# EAGLE design latest_01 (EAGLE 5.09)
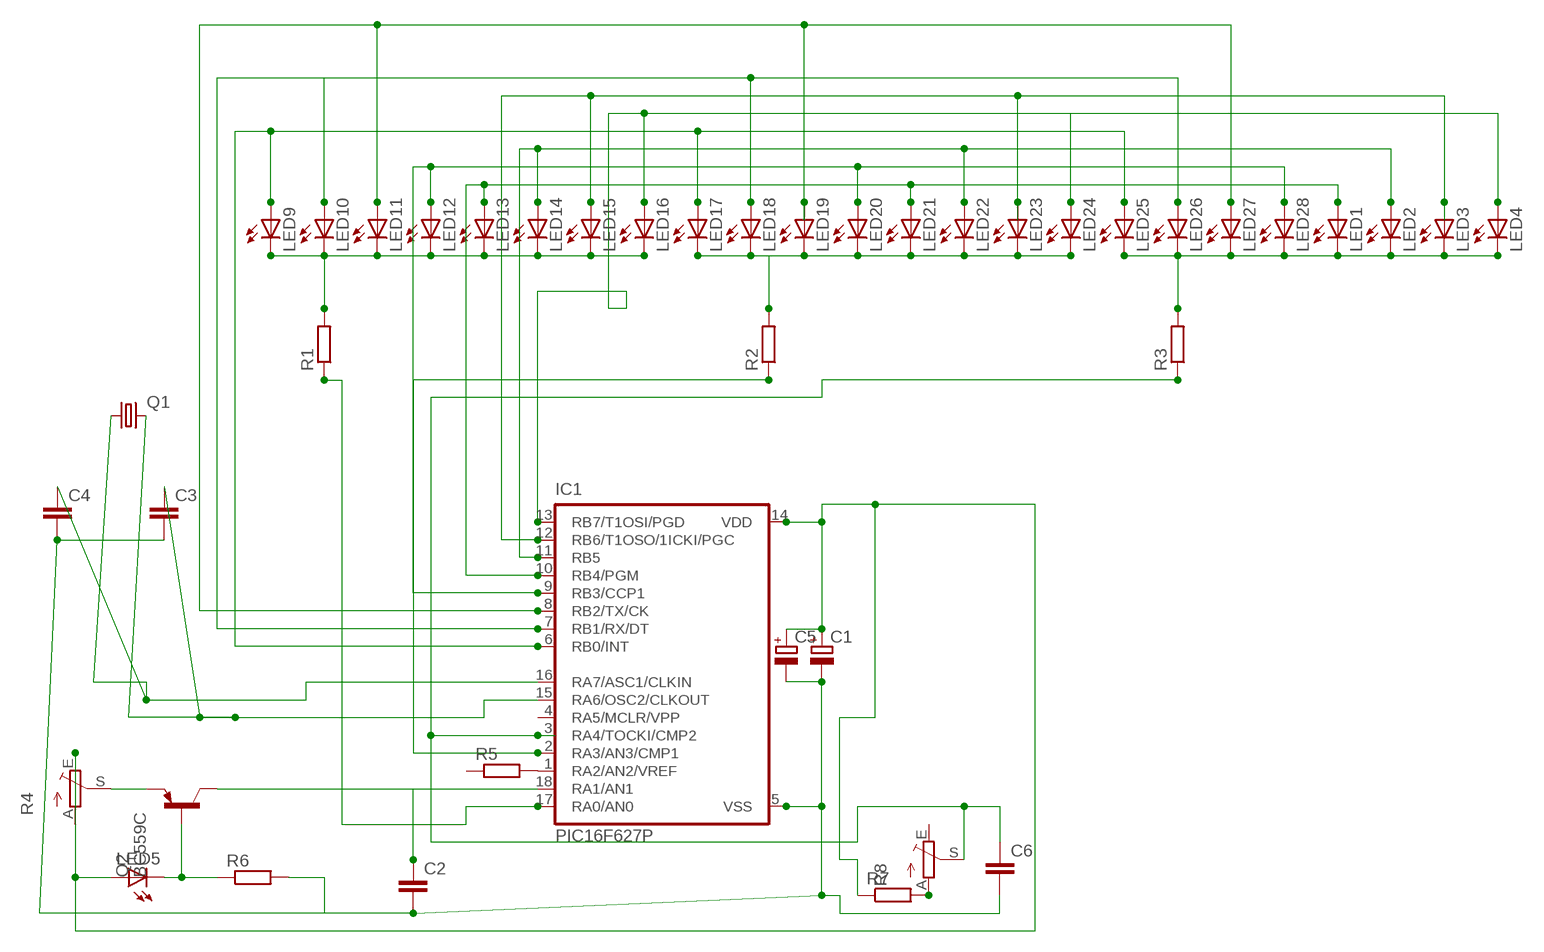
[diagram p0: schematic, sheet 1]

## Parts
C1  CPOL-EUTT6D6  [TT5D6]
C2  C-EU050-030X075  [C050-030X075]
C3  C-EUC1206  [C1206]
C4  C-EUC1206  [C1206]
C5  CPOL-EUSMCE  [SMC_E]
C6  C-EU050-024X044  [C050-024X044]
IC1  PIC16F627P  [DIL18]
LED1  LED5MM  [LED5MM]
LED2  LED5MM  [LED5MM]
LED3  LED5MM  [LED5MM]
LED4  LED5MM  [LED5MM]
LED5  LED3MM  [LED3MM]
LED9  LED5MM  [LED5MM]
LED10  LED5MM  [LED5MM]
LED11  LED5MM  [LED5MM]
LED12  LED5MM  [LED5MM]
LED13  LED5MM  [LED5MM]
LED14  LED5MM  [LED5MM]
LED15  LED5MM  [LED5MM]
LED16  LED5MM  [LED5MM]
LED17  LED5MM  [LED5MM]
LED18  LED5MM  [LED5MM]
LED19  LED5MM  [LED5MM]
LED20  LED5MM  [LED5MM]
LED21  LED5MM  [LED5MM]
LED22  LED5MM  [LED5MM]
LED23  LED5MM  [LED5MM]
LED24  LED5MM  [LED5MM]
LED25  LED5MM  [LED5MM]
LED26  LED5MM  [LED5MM]
LED27  LED5MM  [LED5MM]
LED28  LED5MM  [LED5MM]
Q1  CRYSTALHC49U-LM  [HC49U-LM]
Q2  BC559C  [TO92-EBC]
R1  R-EU_0207/15  [0207/15]
R2  R-EU_0204/7  [0204/7]
R3  R-EU_0204/7  [0204/7]
R4  TRIM_EU-RJ9W  [RJ9W]
R5  R-EU_0207/10  [0207/10]
R6  R-EU_0207/10  [0207/10]
R7  R-EU_0207/15  [0207/15]
R8  TRIM_EU-CA6H  [CA6H]

## Nets
N$1: LED9.K(C) LED10.K(C) LED11.K(C) LED12.K(C) LED13.K(C) LED14.K(C) LED15.K(C) LED16.K(C) R1.2
N$2: IC1.6(RB0/INT) LED9.A LED17.A LED25.A
N$3: LED17.K(C) LED18.K(C) LED19.K(C) LED20.K(C) LED21.K(C) LED22.K(C) LED23.K(C) LED24.K(C) R2.2
N$4: LED1.K(C) LED2.K(C) LED3.K(C) LED4.K(C) LED25.K(C) LED26.K(C) LED27.K(C) LED28.K(C) R3.2
N$5: IC1.8(RB2/TX/CK) LED11.A LED19.A LED27.A
N$7: IC1.9(RB3/CCP1) LED12.A LED20.A LED28.A
N$8: IC1.10(RB4/PGM) LED1.A LED13.A LED21.A
N$9: IC1.11(RB5) LED2.A LED14.A LED22.A
N$10: IC1.12(RB6/T1OSO/1ICKI/PGC) LED3.A LED15.A LED23.A
N$11: IC1.13(RB7/T1OSI/PGD) LED4.A LED16.A LED24.A
N$12: IC1.17(RA0/AN0) R1.1
N$13: IC1.2(RA3/AN3/CMP1) R2.1
N$14: C6.1 IC1.3(RA4/TOCKI/CMP2) R3.1 R8.S
N$15: R7.2 R8.A
N$16: C1.+ C5.+ IC1.14(VDD) LED5.A R4.E R7.1
N$17: C2.1 IC1.18(RA1/AN1) Q2.C
N$18: IC1.1(RA2/AN2/VREF) R5.2
N$19: C4.1 IC1.16(RA7/ASC1/CLKIN) Q1.1
N$20: C3.1 IC1.15(RA6/OSC2/CLKOUT) Q1.2
N$21: IC1.7(RB1/RX/DT) LED10.A LED18.A LED26.A
N$31: C1.- C2.2 C3.2 C4.2 C5.- C6.2 IC1.5(VSS) R6.2
N$34: Q2.E R4.S
N$35: LED5.K(C) Q2.B R6.1
Unconnected: IC1.4(RA5/MCLR/VPP) R4.A R5.1 R8.E

## Library data of the parts
C1 C5 = rcl:CPOL-EU: POLARIZED CAPACITOR, European symbol
C2-C4 C6 = rcl:C-EU: CAPACITOR, European symbol
IC1 = microchip:PIC16*F62: FLASH-Based 8-Bit CMOS Microcontroller Source: http://ww1.microchip.com/downloads/en/DeviceDoc/40300C.pdf
LED1-LED5 LED9-LED28 = led:LED: LED OSRAM: - CHIPLED LG R971, LG N971, LY N971, LG Q971, LY Q971, LO R971, LY R971 LH N974, LH R974 LS Q976, LO Q976, LY Q976 LO Q996 - Hyper CHIPLED LW Q18S LB Q993, LB Q99A, LB R99A - SideLED LS A670, LO A670, LY A670, LG A670, LP A670 LB A673, LV A673, LT A673, LW A673 LH A674 LY A675 LS A676, LA A676, LO A676, LY A676, LW A676 LS A679, LY A679, LG A679 - Hyper Micro SIDELED® LS Y876, LA Y876, LO Y876, LY Y876 LT Y87S - SmartLED LW L88C, LW L88S LB L89C, LB L89S, LG L890 LS L89K, LO L89K, LY L89K LS L896, LA L896, LO L896, LY L896 - TOPLED LS T670, LO T670, LY T670, LG T670, LP T670 LSG T670, LSP T670, LSY T670, LOP T670, LYG T670 LG T671, LOG T671, LSG T671 LB T673, LV T673, LT T673, LW T673 LH T674 LS T676, LA T676, LO T676, LY T676, LB T676, LH T676, LSB T676, LW T676 LB T67C, LV T67C, LT T67C, LS T67K, LO T67K, LY T67K, LW E67C LS E67B, LA E67B, LO E67B, LY E67B, LB E67C, LV E67C, LT E67C LW T67C LS T679, LY T679, LG T679 LS T770, LO T770, LY T770, LG T770, LP T770 LB T773, LV T773, LT T773, LW T773 LH T774 LS E675, LA E675, LY E675, LS T675 LS T776, LA T776, LO T776, LY T776, LB T776 LHGB T686 LT T68C, LB T68C - Hyper Mini TOPLED® LB M676 - Mini TOPLED Santana® LG M470 LS M47K, LO M47K, LY M47K Source: http://www.osram.convergy.de LUXEON: - LUMILED® LXK2-PW12-R00, LXK2-PW12-S00, LXK2-PW14-U00, LXK2-PW14-V00 LXK2-PM12-R00, LXK2-PM12-S00, LXK2-PM14-U00 LXK2-PE12-Q00, LXK2-PE12-R00, LXK2-PE12-S00, LXK2-PE14-T00, LXK2-PE14-U00 LXK2-PB12-K00, LXK2-PB12-L00, LXK2-PB12-M00, LXK2-PB14-N00, LXK2-PB14-P00, LXK2-PB14-Q00 LXK2-PR12-L00, LXK2-PR12-M00, LXK2-PR14-Q00, LXK2-PR14-R00 LXK2-PD12-Q00, LXK2-PD12-R00, LXK2-PD12-S00 LXK2-PH12-R00, LXK2-PH12-S00 LXK2-PL12-P00, LXK2-PL12-Q00, LXK2-PL12-R00 Source: www.luxeon.com KINGBRIGHT: KA-3528ASYC Source: www.kingbright.com
Q1 = crystal:CRYSTAL: CRYSTAL
Q2 = transistor-pnp:BC559*: PNP Transistror
R1-R3 R6 = resistor:R-EU_: RESISTOR, European symbol
R4 R8 = pot:TRIM_EU-: POTENTIOMETER
R5 R7 = rcl:R-EU_: RESISTOR, European symbol

## Board
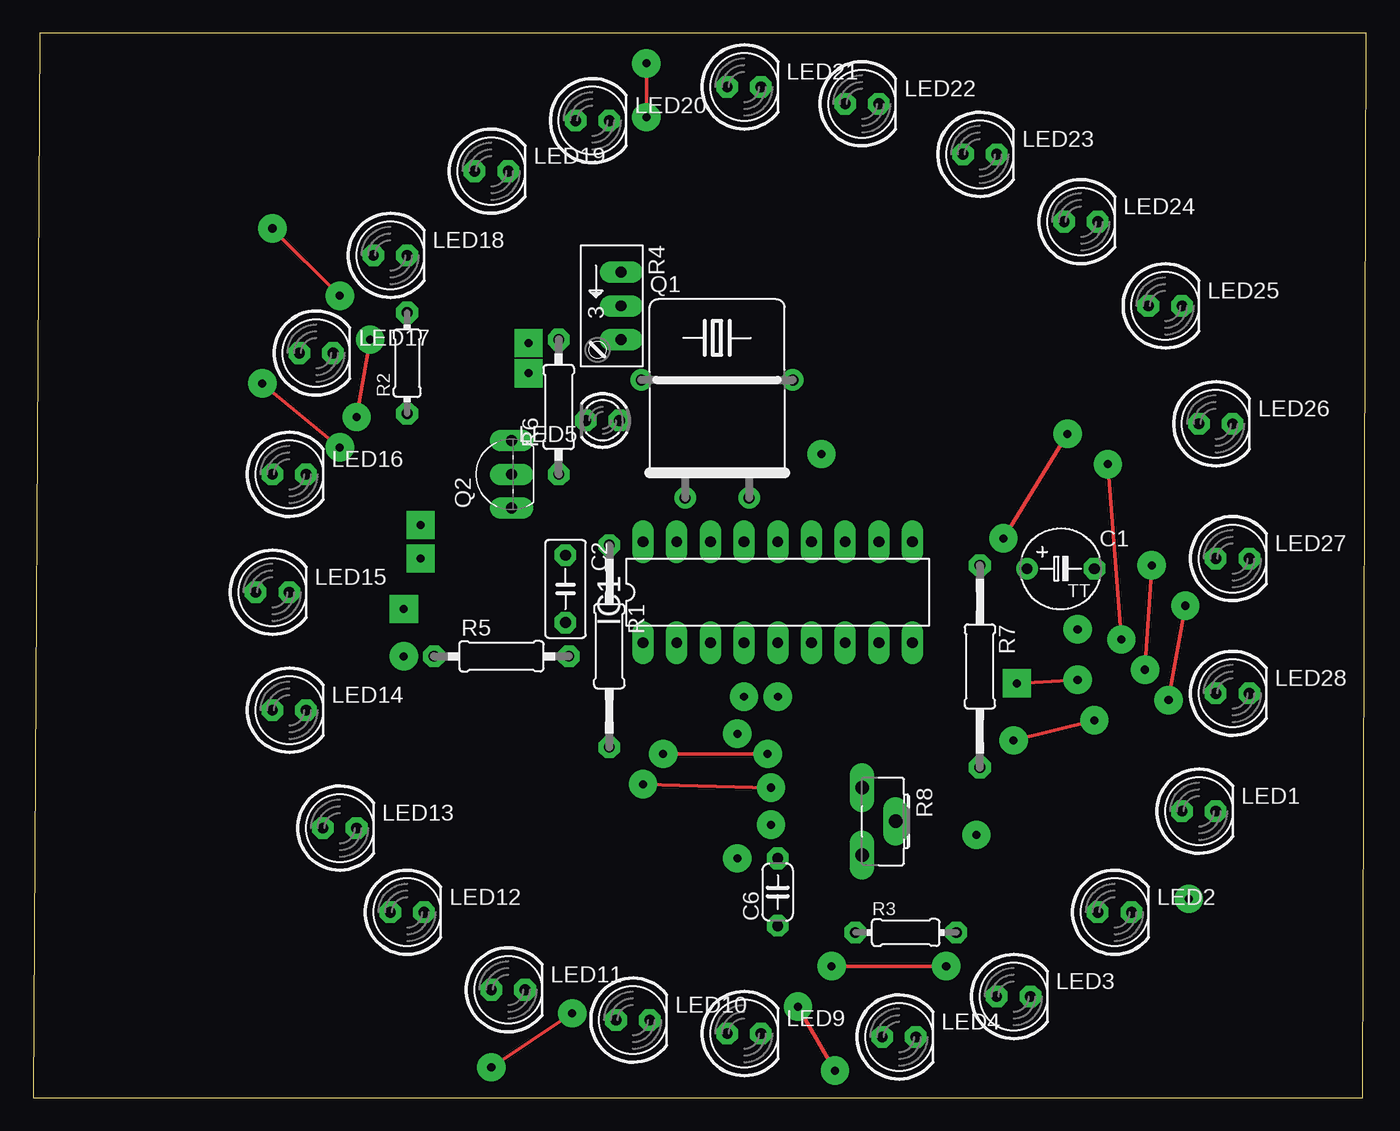
[diagram p1: board, top side]
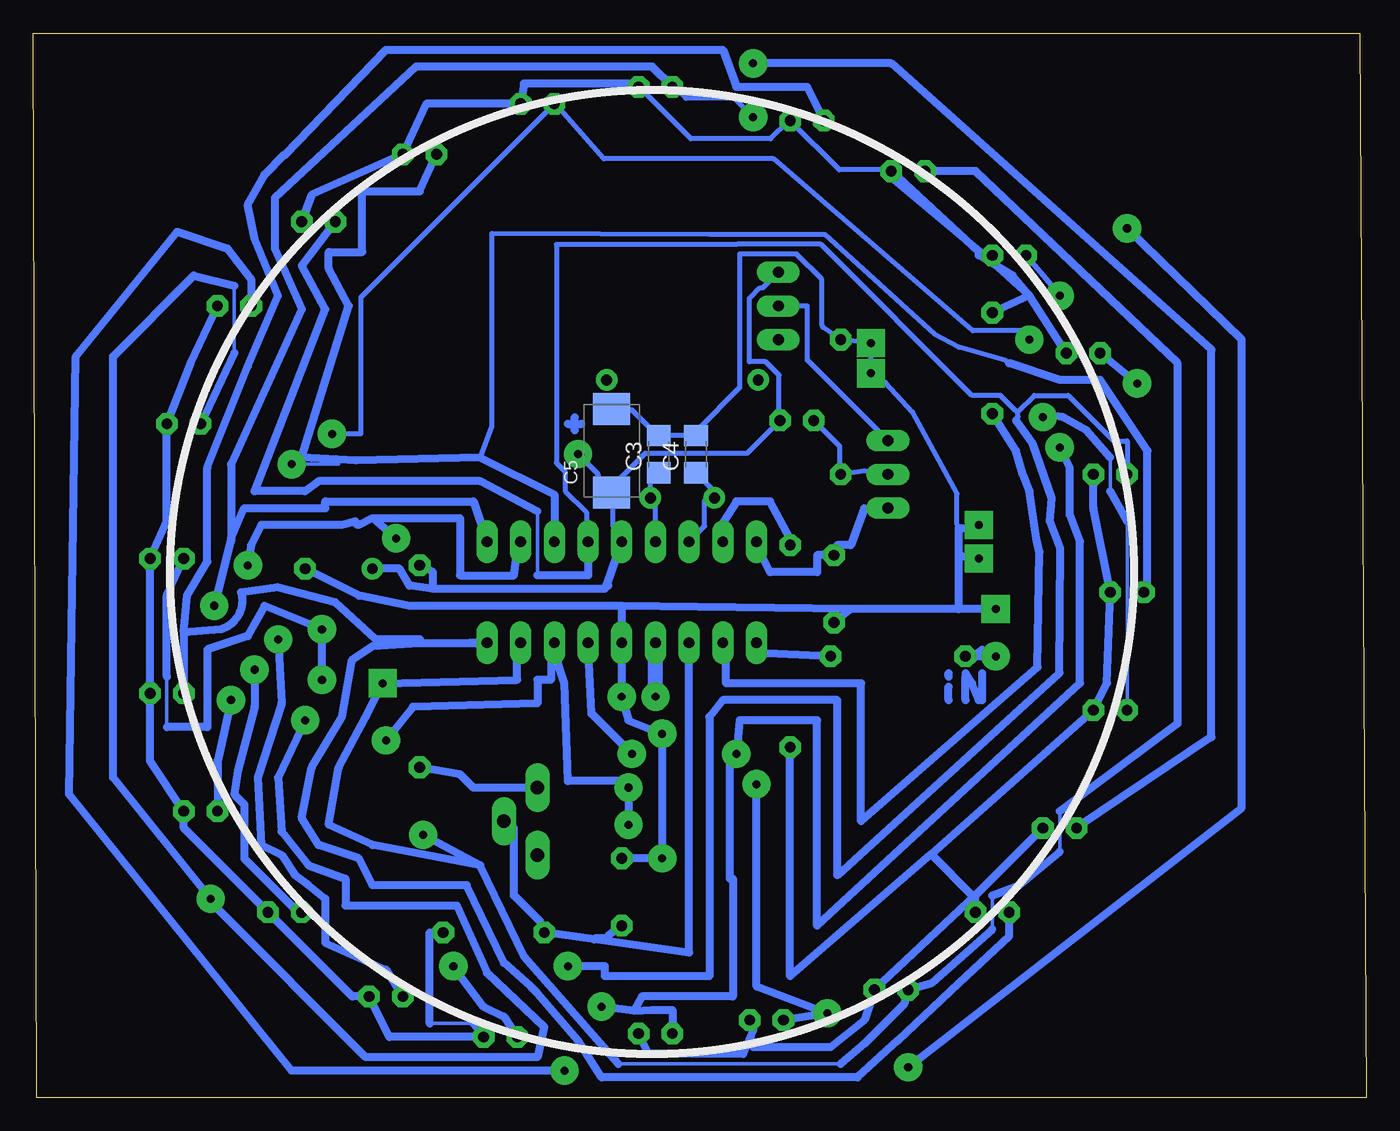
[diagram p2: board, bottom side, seen from below]

Size 100.51 x 80.25 mm. Coordinates in mm from the lower left corner, seen from the top.
Outline: 0,0 100.25,0 100.51,80.25 0.51,80.25 0,0
Copper layers (1*16): Top 0.035mm / dielectric 1.5mm / Bottom 0.035mm
Design rules "default *": minimum track width 15mil, minimum drill 24mil, track to track 14mil, track to pad 14mil, pad to pad 8mil, via to via 8mil, smd to smd 8mil, copper to edge 40mil, drill to drill 8mil, minimum pad ring 16mil, minimum via ring 30mil, stop-mask expansion 4mil, vias tented up to drill 0mil, thermal gap 10mil

### Footprints (pad centres in the part's own frame; a part is rotated, then mirrored left to right if it is on the bottom)
TT5D6 = drill 0.813 round: + -2.54,0 | drill 0.813 octagon: - 2.54,0
C050-030X075 = drill 0.813 octagon: 1 -2.54,0; 2 2.54,0
C1206 = smd 1.6 x 1.8: 1 -1.4,0; 2 1.4,0
SMC_E = smd 2.4 x 2.8: + -3.15,0; - 3.15,0
C050-024X044 = drill 0.813 octagon: 1 -2.54,0; 2 2.54,0
DIL18 = drill 0.813 long: 1 -10.16,-3.81; 2 -7.62,-3.81; 3 -5.08,-3.81; 4 -2.54,-3.81; 5 0,-3.81; 6 2.54,-3.81; 7 5.08,-3.81; 8 7.62,-3.81; 9 10.16,-3.81; 10 10.16,3.81; 11 7.62,3.81; 12 5.08,3.81; 13 2.54,3.81; 14 0,3.81; 15 -2.54,3.81; 16 -5.08,3.81; 17 -7.62,3.81; 18 -10.16,3.81
LED5MM = drill 0.813 octagon: A -1.27,0; K 1.27,0
LED3MM = drill 0.813 octagon: A -1.27,0; K 1.27,0
HC49U-LM = drill 0.813 round: 1 -2.413,-5.08; 2 2.413,-5.08; M -5.715,3.81; M1 5.715,3.81
TO92-EBC = drill 0.813 long: B 0,-1.27; C -2.54,-1.27; E 2.54,-1.27
0207/15 = drill 0.813 octagon: 1 -7.62,0; 2 7.62,0
0204/7 = drill 0.813 octagon: 1 -3.81,0; 2 3.81,0
RJ9W = drill 0.813 long: A 2.54,0.635; E -2.54,0.635; S 0,0.635
0207/10 = drill 0.813 octagon: 1 -5.08,0; 2 5.08,0
CA6H = drill 1.016 long: A -2.54,0; E 2.54,0; S 0,2.54

### Placement (x,y rotation side)
C1  77.47,39.88 0 top
C2  40.13,38.35 270 top
C3  53.34,48.51 90 bottom
C4  50.55,48.51 90 bottom
C5  56.9,48.77 90 bottom
C6  56.13,15.49 90 top
IC1  56.13,38.1 0 top
LED1  87.88,21.59 0 top
LED2  81.53,13.97 0 top
LED3  73.91,7.62 0 top
LED4  65.28,4.57 0 top
LED5  42.93,51.05 180 top
LED9  53.59,4.83 0 top
LED10  45.21,5.84 0 top
LED11  35.81,8.13 0 top
LED12  28.19,13.97 0 top
LED13  23.11,20.32 0 top
LED14  19.3,29.21 0 top
LED15  18.03,38.1 0 top
LED16  19.3,46.99 0 top
LED17  21.34,56.13 0 top
LED18  26.92,63.5 0 top
LED19  34.54,69.85 0 top
LED20  42.16,73.66 0 top
LED21  53.59,76.2 0 top
LED22  62.48,74.93 0 top
LED23  71.37,71.12 0 top
LED24  78.99,66.04 0 top
LED25  85.34,59.69 0 top
LED26  89.15,50.8 0 top
LED27  90.42,40.64 0 top
LED28  90.42,30.48 0 top
Q1  51.56,50.29 0 top
Q2  34.8,46.99 90 top
R1  43.43,34.04 270 top
R2  28.19,55.37 90 top
R3  65.79,12.45 0 top
R4  43.69,59.69 270 top
R5  35.31,33.27 0 top
R6  39.62,52.07 90 top
R7  71.37,32.51 270 top
R8  62.48,20.83 270 top

### Tracks (layer width: path | path; a pad name or v marks a point on that pad's centre or on a via)
N$1
  Bottom 0.254: 46.23,3.81 46.23,5.08 | 29.46,15.24 29.72,15.24 | 32.77,18.29 32.81,18.34
  Bottom 0.61: LED12.K 29.46,15.24 | 29.46,15.24 LED13.K | 29.46,15.24 LED11.K 37.85,5.84 40.39,3.81 46.23,3.81 | R1.2 43.43,9.14 32.81,18.34 LED14.K 19.56,31.24 LED15.K 20.57,44.45 LED16.K | LED9.K 54.1,3.3 46.99,3.3 46.23,5.08 LED10.K | 29.72,15.24 32.77,18.29
N$2  (via drill 0.61)
  Top 0.254: v23.11,49.02 v17.27,53.85 | v47.5,25.91 v55.37,25.91 | v57.66,6.86 v60.45,2.03
  Bottom 0.254: 48.01,16.51 47.75,16.51
  Bottom 0.61: v17.27,53.85 LED17.A | IC1.6 58.42,28.96 v55.37,25.91 | v60.45,2.03 81.03,2.03 97.79,22.86 97.28,55.88 89.66,65.28 85.85,64.01 84.07,61.72 LED25.A | v23.11,49.02 22.35,47.5 22.35,43.94 21.59,41.91 21.59,31.24 41.4,12.95 41.4,28.45 47.24,28.45 v47.5,25.91 48.01,25.15 48.01,16.51 | 47.75,16.51 47.75,7.62 54.61,7.62 55.22,6.55 | 55.22,6.55 v57.66,6.86 | LED9.A 52.32,6.6 53.85,6.6 55.22,6.55
N$3
  Bottom 0.254: 29.21,63.75 LED18.K | LED21.K 55.12,76.45
  Bottom 0.381: LED19.K 36.12,69.95 39.73,69.95 LED20.K 43.61,73.58 44.91,72.29 50.93,72.29 54.76,76.12 LED21.K
  Bottom 0.61: LED24.K 79.5,68.07 LED23.K 70.87,74.93 LED22.K 63.5,76.45 55.12,76.45 | LED17.K 25.4,60.45 | 25.4,60.45 26.67,61.98 29.21,63.5 | 29.21,63.5 29.21,63.75 LED19.K | 28.19,62.99 29.21,63.5 | 28.19,62.99 35.81,69.34 | 25.4,60.45 28.19,62.99 | 25.4,60.45 R2.2
N$4
  Bottom 0.254: 67.31,5.59 70.61,5.59
  Bottom 0.61: LED25.K 88.65,55.37 LED26.K 90.42,43.43 LED27.K LED28.K 91.69,25.4 LED1.K 89.15,20.32 LED2.K 76.45,7.62 LED3.K 73.66,4.57 LED4.K 67.31,5.59 | 70.61,5.59 70.61,12.45 R3.2
N$5  (via drill 0.6, 0.6 pad 1.93, 0.61)
  Top 0.254: v74.17,31.24 v78.74,31.5
  Bottom 0.254: 23.11,18.54 23.11,21.59 | 28.19,12.7 28.19,15.24 | 90.42,27.94 90.42,31.75 | 37.85,4.06 37.92,4.14 | 39.62,2.54 56.39,2.54
  Bottom 0.61: LED19.A 29.46,69.85 14.22,55.37 14.22,28.19 23.11,21.59 | 23.11,18.54 26.16,16 28.19,15.24 | 28.19,12.7 32.77,8.64 LED11.A 34.8,7.11 37.85,4.06 39.62,2.54 | LED27.A 90.42,37.85 90.42,31.75 | 90.42,27.94 87.38,27.94 87.38,33.78 84.33,34.8 83.06,37.08 v78.74,35.31 v78.74,31.5 | IC1.8 64.01,34.29 64.01,31.5 v74.17,31.24 75.44,28.7 77.47,24.89 78.23,20.57 74.93,19.05 66.8,17.53 | 56.39,2.54 63.5,10.67 66.8,17.53 | 66.8,17.53 v71.12,19.81
N$7
  Bottom 0.254: 81.53,71.12 81.51,71.08 | 71.37,34.29 71.37,34.54
  Bottom 0.61: 89.15,35.05 LED28.A | 67.56,34.29 IC1.9 71.37,34.29 74.93,34.04 76.45,33.02 77.22,28.7 79.5,24.89 80.26,21.08 78.99,19.05 75.95,18.03 74.93,16 67.82,16 65.02,10.16 62.99,8.38 62.48,7.87 59.44,4.32 57.66,1.52 38.35,1.52 35.31,4.32 30.73,8.64 26.92,12.19 LED12.A | 89.15,35.05 86.36,35.31 arc-90 84.84,38.1 82.09,38.47 77.72,37.34 74.68,34.54 71.37,34.54 | 81.51,71.08 73.91,78.99 48.51,78.99 47.5,76.2 42.16,76.2 LED20.A | 81.53,71.12 83.06,69.6 84.33,67.31 83.82,64.77 82.04,60.45 84.33,55.12 87.38,47.5 87.38,40.39 88.9,37.85 89.15,35.05
N$8  (via drill 0.61)
  Top 0.254: v46.23,77.98 v46.23,73.91 | v86.87,37.08 v85.6,29.97
  Bottom 0.381: v46.23,73.91 47.65,75.34 51.31,75.34 52.04,76.07 LED21.A
  Bottom 0.61: LED13.A 11.68,27.18 11.68,56.39 35.81,77.98 v46.23,77.98 | LED1.A 86.61,25.4 v85.6,29.97 | 85.6,42.16 84.58,44.45 78.49,44.45 78.49,44.96 67.31,44.96 IC1.10 | 85.6,42.16 85.6,47.75 80.26,59.44 82.3,64.01 82.3,67.82 71.63,77.72 53.85,77.72 LED21.A | 85.6,42.16 85.6,41.91 | 85.6,42.16 v86.87,37.08
N$9  (via drill 0.61)
  Top 0.254: v84.33,40.13 v83.82,32.26 | v24.38,51.31 v25.4,57.15 | v77.98,50.04 v73.15,42.16
  Bottom 0.254: LED14.A 18.03,43.43 | 19.3,45.72 19.3,48.26
  Bottom 0.381: v77.98,50.04 75.82,50.04 75.82,60.33 LED22.A 61.04,74.85 57.48,70.79 44.7,70.79 29.69,57.81 26.06,57.81 v25.4,57.15
  Bottom 0.61: LED2.A 80.52,13.97 84.58,18.03 84.58,22.1 85.34,22.86 85.09,24.64 83.82,29.46 v83.82,32.26 | 18.03,43.43 19.3,45.72 | 19.3,48.26 21.08,50.29 22.86,51.31 24.89,51.56 v24.38,51.31 | v84.33,40.13 84.07,41.66 83.31,43.18 77.22,43.18 76.2,43.43 arc-90 75.95,43.18 74.93,43.69 | 74.93,43.69 68.33,43.69 68.33,39.37 64.26,39.37 64.01,41.15 IC1.11 | v73.15,42.16 74.93,43.69
N$10  (via drill 0.61)
  Top 0.254: v81.03,47.75 v82.04,34.54
  Bottom 0.254: LED15.A 16.51,38.61 | v81.03,47.75 77.47,47.75
  Bottom 0.381: 26.92,55.37 27.18,55.55 30.73,56.57 32.56,57.58 40.82,65.08 49.5,65.08 65.94,65.15 65.94,50.6 66.8,48.26
  Bottom 0.61: LED3.A 73.91,9.65 78.49,11.68 78.49,14.99 79.76,16 80.77,16.76 81.79,18.29 83.31,19.05 83.57,24.13 81.79,29.72 v82.04,34.54 | 80.26,48.26 76.71,59.69 78.23,62.48 78.23,63.75 75.69,63.75 75.69,68.33 71.37,68.33 LED23.A | 80.26,48.26 76.17,48.03 66.8,48.26 61.21,45.47 IC1.12 | 16.51,38.61 16.51,48.77 20.07,54.1 23.11,54.1 26.92,55.37 | 80.26,48.26 v81.03,47.75
N$11  (via drill 0.61)
  Top 0.254: v60.2,9.91 v68.83,9.91
  Bottom 0.254: 62.48,39.37 62.48,44.2
  Bottom 0.381: LED16.A 18.03,49.51 19.05,49.51 22.48,52.93 25.04,52.93 26.26,51.71 | 26.26,51.71 26.26,51.33 26.42,51.05 | IC1.13 58.8,42.19 58.8,44.15 60.4,45.74 60.4,47.19 61.06,47.85 61.06,64.31 47.47,64.31 47.45,64.34 41.12,64.34 29.72,52.93 27.58,52.93 26.44,51.79 26.26,51.71
  Bottom 0.61: v68.83,9.91 66.55,6.86 65.02,6.1 LED4.A | v60.2,9.91 57.4,9.91 57.4,9.14 49.53,9.14 49.53,28.7 48.51,29.97 39.88,29.97 39.88,16.76 23.14,32.02 23.08,41.35 23.88,43.43 23.72,45.18 25.15,49.28 26.42,51.05 | LED24.A 80.26,62.74 78.49,59.44 83.82,45.72 80.01,45.72 78.99,46.48 66.8,46.48 62.48,44.2 | IC1.13 58.67,39.37 62.48,39.37
N$12
  Bottom 0.61: R1.1 43.18,41.66 44.96,44.96 47.5,44.96 48.77,42.93 IC1.17
N$13
  Bottom 0.61: IC1.2 48.26,33.53 48.26,31.24 38.1,31.24 38.1,20.83 24.79,32.45 24.64,41.15 24.89,42.16 25.4,45.72 25.91,46.99 26.42,48.77 R2.1
N$14
  Bottom 0.254: 57.15,12.19 58.17,12.19 58.2,11.92
  Bottom 0.61: IC1.3 51.05,10.92 58.2,11.92 R3.1 62.23,13.21 64.26,15.24 64.26,20.32 R8.S | 57.15,12.19 C6.1
N$15
  Bottom 0.61: R7.2 68.33,24.38 67.31,23.37 R8.A
N$16  (via drill 0.6 pad 1.93)
  Bottom 0.254: IC1.14 56.13,41.66
  Bottom 0.381: C5.+ 57.91,46.48 | C5.+ 57.96,46.79 57.89,46.97 v59.44,48.51 | 56.26,42.95 IC1.14 56.36,43.13 56.82,43.13 56.82,45.44 C5.+ | C5.+ 57.84,45.44 | C5.+ 56.97,45.97 54.38,48.56 46.68,48.56 LED5.A 44.27,51.23 44.27,54.46 45.29,55.47 46.51,55.47 46.51,60.25 45.7,61.06 45.49,61.06 R4.E
  Bottom 0.61: 57.29,38.66 57.4,38.35 70.36,38.35 | 57.29,38.66 IC1.14 56.13,42.67 | 70.36,38.35 72.14,38.61 72.9,39.88 C1.+ | 57.29,38.66 57.15,38.61 | R7.1 70.36,39.62 70.36,38.35
N$17
  Bottom 0.254: 45.97,41.66 IC1.18 | Q2.C 37.85,44.45
  Bottom 0.61: 45.97,41.66 44.96,39.62 41.4,39.62 41.4,40.89 C2.1 39.88,41.66 38.86,41.66 37.85,44.45
N$18
  Bottom 0.61: R5.2 45.97,33.53 IC1.1
N$19
  Bottom 0.381: C4.1 50.55,47.09 49.15,45.7 Q1.1 49.22,45.03 49.89,45.03 49.89,43.08 IC1.16
N$20
  Bottom 0.381: C3.1 53.34,47.09 53.97,46.46 Q1.2 53.8,45.14 53.59,45.14 IC1.15
N$21  (via drill 0.6 pad 1.93, 0.61)
  Top 0.254: v73.91,26.92 v80.01,28.45 | v45.97,23.62 v55.63,23.37 | v34.54,2.29 v40.64,6.35 | v18.03,65.53 v23.11,60.45
  Bottom 0.254: 85.34,61.21 85.34,56.13 | 86.61,14.22 v87.12,14.99 | 61.21,33.53 IC1.7
  Bottom 0.406: LED18.A 24.13,61.72 v23.11,60.45
  Bottom 0.61: v73.91,26.92 71.88,29.46 62.48,29.72 62.48,31.5 61.47,31.5 61.47,34.29 IC1.7 | v87.12,14.99 94.49,24.13 94.49,55.88 88.39,61.98 85.34,61.21 | 85.34,56.13 LED26.A | v18.03,65.53 9.4,57.15 9.4,21.84 v34.54,2.29 | LED10.A v40.64,6.35 45.97,8.38 v45.97,23.62 | v80.01,28.45 82.04,24.13 81.79,20.07 79.76,17.53 76.96,16.51 76.96,14.48 68.58,14.48 66.29,9.4 61.98,5.33 62.48,3.05 75.44,3.05 86.61,14.22 | v55.63,20.57 v55.63,23.37 56.13,23.88 60.2,23.88 60.45,31.24 61.21,33.53
N$22  (via drill 0.6 pad 1.93)
  Bottom 0.406: 53.85,30.23 v53.59,30.23 53.34,30.23 | 53.34,35.05 53.85,35.05
  Bottom 0.61: 53.85,30.23 53.85,35.05 | 53.34,30.23 53.34,35.05
N$31  (via drill 0.6, 0.6 pad 1.93)
  Bottom 0.254: 56.13,34.54 IC1.5
  Bottom 0.381: C4.2 | 57.91,51.92 C5.- 56.72,51.84 55.37,51.84 53.52,49.99 C3.2 50.75,49.91 C4.2 | 30.73,42.93 30.86,43.2 30.86,45.54 34.21,51.69 36.25,53.92 v37.34,54.61 v37.34,56.9 R6.2 40.97,58.09 41.05,58.27 41.05,61.7 42.95,63.6 47.24,63.6 47.24,53.52 50.47,50.29 C4.2 | C4.2 50.47,50.09
  Bottom 0.61: 56.13,37.08 56.13,34.54 | 56.13,37.08 72.14,37.08 75.95,37.85 C1.- | IC1.5 v56.13,30.23 55.63,28.45 v53.09,27.43 v53.09,18.03 C6.2 | 38.86,36.83 C2.2 | 38.86,36.83 56.13,37.08 | 30.73,36.83 38.86,36.83 | 29.46,42.93 30.73,42.93 30.73,40.89 | 30.73,40.89 29.72,40.64 | 30.73,36.83 30.73,40.89 | v27.94,36.83 30.73,36.83
N$34
  Bottom 0.381: Q2.E 42.14,55.6 42.14,59.69 R4.S
N$35
  Bottom 0.381: Q2.B 37.85,47.24 R6.1 39.7,47.17 39.7,49.1 LED5.K
N$36  (via drill 0.6)
  Bottom 0.61: v27.94,33.27 29.72,33.27 28.96,33.78
N$37
  Bottom 0.61: 31.5,31.75 31.5,32
N$38
  Bottom 0.61: 31.5,29.97 31.5,30.99
N$39
  Bottom 0.61: 30.23,29.97 30.23,31.75
N$40  (via drill 0.6)
  other vias: 29.21,40.64
N$41  (via drill 0.6)
  other vias: 29.21,43.18
N$42
  Bottom 0.61: 30.23,32 29.72,31.24 29.21,29.97
N$43
  Bottom 0.61: 28.96,29.97 28.96,32
N$44
  Bottom 0.61: 60.2,50.8 59.18,50.8
N$45
  Bottom 0.61: 59.69,50.29 59.69,51.31